# Altium schematic sheet BMD_RevB_B2_TX.SchDoc: TargetX
size 401 x 291 mm; DocumentNumber: 2; SheetNumber: 2; SheetTotal: 6
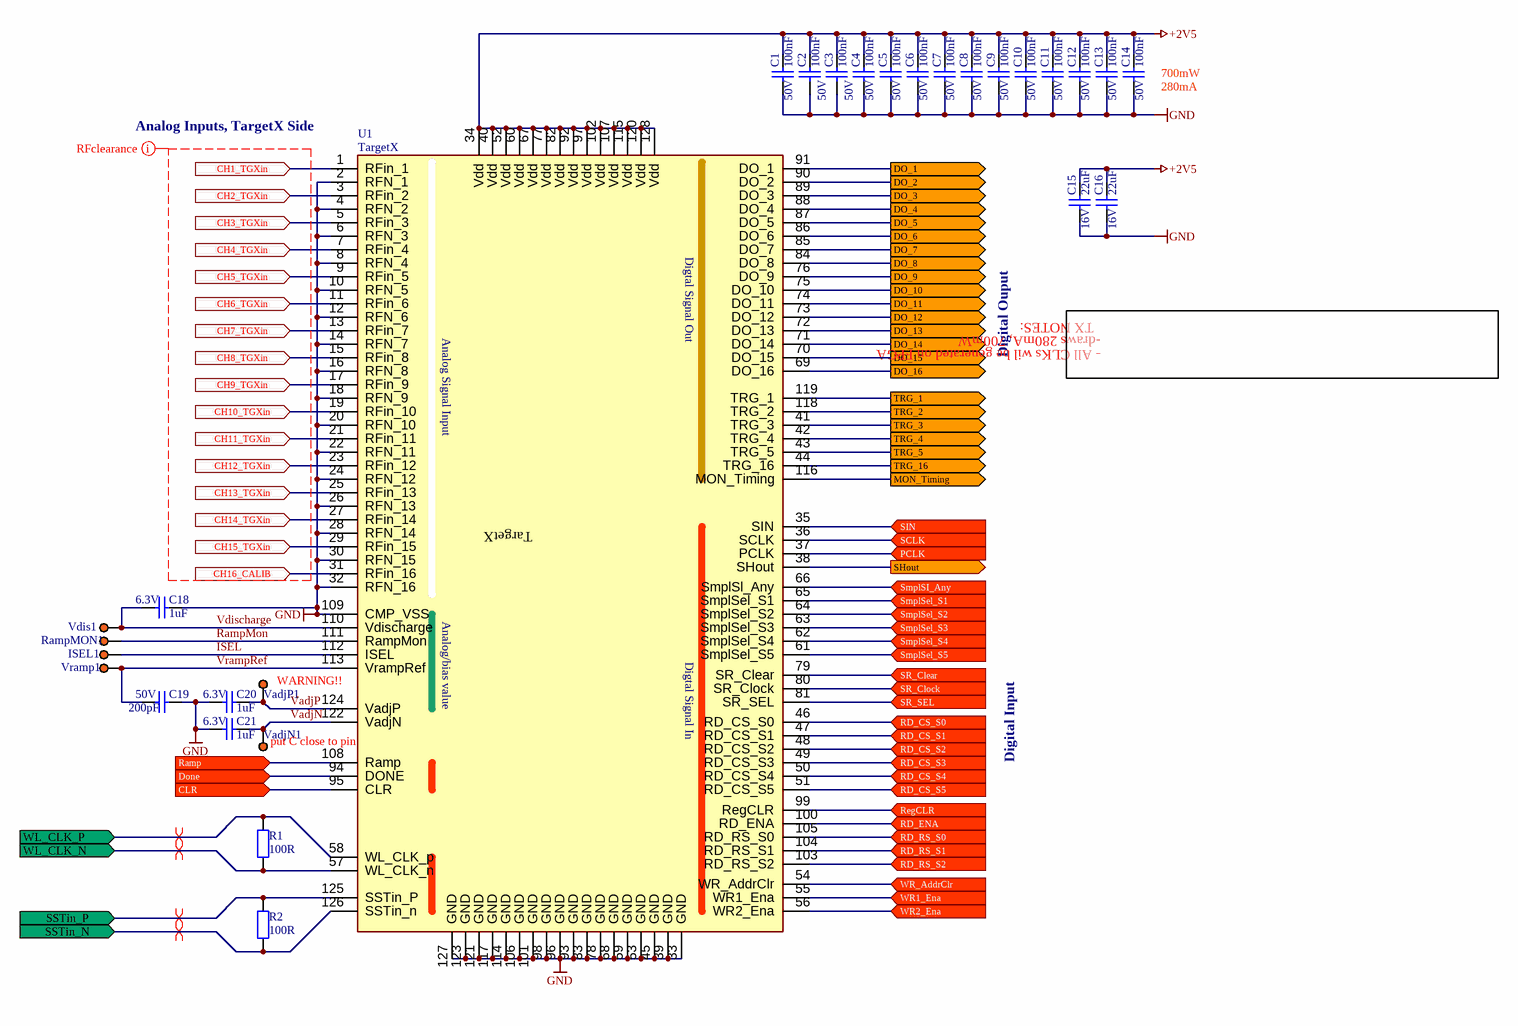
[diagram p0: BMD_RevB_B2_TX.SchDoc]

## Parts
C1  100nF  Voltage rating: 50V  [CC0402N1R]
C2  100nF  Voltage rating: 50V  [CC0402N1R]
C3  100nF  Voltage rating: 50V  [CC0402N1R]
C4  100nF  Voltage rating: 50V  [CC0402N1R]
C5  100nF  Voltage rating: 50V  [CC0402N1R]
C6  100nF  Voltage rating: 50V  [CC0402N1R]
C7  100nF  Voltage rating: 50V  [CC0402N1R]
C8  100nF  Voltage rating: 50V  [CC0402N1R]
C9  100nF  Voltage rating: 50V  [CC0402N1R]
C10  100nF  Voltage rating: 50V  [CC0402N1R]
C11  100nF  Voltage rating: 50V  [CC0402N1R]
C12  100nF  Voltage rating: 50V  [CC0402N1R]
C13  100nF  Voltage rating: 50V  [CC0402N1R]
C14  100nF  Voltage rating: 50V  [CC0402N1R]
C15  22uF  Voltage rating: 16V  [CC0805N1R]
C16  22uF  Voltage rating: 16V  [CC0805N1R]
C18  1uF  Voltage rating: 6.3V  [CC0402N1R]
C19  200pF  Voltage rating: 50V  [CC0402N1R]
C20  1uF  Voltage rating: 6.3V  [CC0402N1R]
C21  1uF  Voltage rating: 6.3V  [CC0402N1R]
ISEL1  SP1.5S  [SP1.5SQ]  (value not drawn)  (no BOM)
R1  100R  [RC0402N1R]
R2  100R  [RC0402N1R]
RampMON1  SP1.5S  [SP1.5SQ]  (value not drawn)  (no BOM)
U1  TargetX  [TQFP128_MZA]
VadjN1  SP1.5S  [SP1.5SQ]  (value not drawn)  (no BOM)
VadjP1  SP1.5S  [SP1.5SQ]  (value not drawn)  (no BOM)
Vdis1  SP1.5S  [SP1.5SQ]  (value not drawn)  (no BOM)
Vramp1  SP1.5S  [SP1.5SQ]  (value not drawn)  (no BOM)

## Ports
CH1_TGXin (in), CH2_TGXin (in), CH3_TGXin (in), CH4_TGXin (in), CH5_TGXin (in), CH6_TGXin (in), CH7_TGXin (in), CH8_TGXin (in), CH9_TGXin (in), CH10_TGXin (in), CH11_TGXin (in), CH12_TGXin (in), CH13_TGXin (in), CH14_TGXin (in), CH15_TGXin (in), CH16_CALIB (in), CLR (in), DO_1 (out), DO_2 (out), DO_3 (out), DO_4 (out), DO_5 (out), DO_6 (out), DO_7 (out), DO_8 (out), DO_9 (out), DO_10 (out), DO_11 (out), DO_12 (out), DO_13 (out), DO_14 (out), DO_15 (out), DO_16 (out), Done (in), MON_Timing (out), PCLK (in), Ramp (in), RD_CS_S0 (in), RD_CS_S1 (in), RD_CS_S2 (in), RD_CS_S3 (in), RD_CS_S4 (in), RD_CS_S5 (in), RD_ENA (in), RD_RS_S0 (in), RD_RS_S1 (in), RD_RS_S2 (in), RegCLR (in), SCLK (in), SHout (out), SIN (in), SmplSel_S1 (in), SmplSel_S2 (in), SmplSel_S3 (in), SmplSel_S4 (in), SmplSel_S5 (in), SmplSI_Any (in), SR_Clear (in), SR_Clock (in), SR_SEL (in), SSTin_N (in), SSTin_P (in), TRG_1 (out), TRG_2 (out), TRG_3 (out), TRG_4 (out), TRG_5 (out), TRG_16 (out), WL_CLK_N (in), WL_CLK_P (in), WR1_Ena (in), WR2_Ena (in), WR_AddrClr (in)

## Nets
+2V5: C1.2 C2.2 C3.2 C4.2 C5.2 C6.2 C7.2 C8.2 C9.2 C10.2 C11.2 C12.2 C13.2 C14.2 C15.2 C16.2 U1.34(Vdd) U1.40(Vdd) U1.52(Vdd) U1.60(Vdd) U1.67(Vdd) U1.77(Vdd) U1.82(Vdd) U1.92(Vdd) U1.97(Vdd) U1.102(Vdd) U1.107(Vdd) U1.115(Vdd) U1.120(Vdd) U1.128(Vdd)
GND: C1.1 C2.1 C3.1 C4.1 C5.1 C6.1 C7.1 C8.1 C9.1 C10.1 C11.1 C12.1 C13.1 C14.1 C15.1 C16.1 C18.2 C19.1 C20.1 C21.1 U1.2(RFN_1) U1.4(RFN_2) U1.6(RFN_3) U1.8(RFN_4) U1.10(RFN_5) U1.12(RFN_6) U1.14(RFN_7) U1.16(RFN_8) U1.18(RFN_9) U1.20(RFN_10) U1.22(RFN_11) U1.24(RFN_12) U1.26(RFN_13) U1.28(RFN_14) U1.30(RFN_15) U1.32(RFN_16) U1.33(GND) U1.39(GND) U1.45(GND) U1.53(GND) U1.59(GND) U1.68(GND) U1.78(GND) U1.83(GND) U1.93(GND) U1.96(GND) U1.98(GND) U1.101(GND) U1.106(GND) U1.109(CMP_VSS) U1.114(GND) U1.117(GND) U1.121(GND) U1.123(GND) U1.127(GND)
CH1_TGXin: U1.1(RFin_1) ; port CH1_TGXin
CH2_TGXin: U1.3(RFin_2) ; port CH2_TGXin
CH3_TGXin: U1.5(RFin_3) ; port CH3_TGXin
CH4_TGXin: U1.7(RFin_4) ; port CH4_TGXin
CH5_TGXin: U1.9(RFin_5) ; port CH5_TGXin
CH6_TGXin: U1.11(RFin_6) ; port CH6_TGXin
CH7_TGXin: U1.13(RFin_7) ; port CH7_TGXin
CH8_TGXin: U1.15(RFin_8) ; port CH8_TGXin
CH9_TGXin: U1.17(RFin_9) ; port CH9_TGXin
CH10_TGXin: U1.19(RFin_10) ; port CH10_TGXin
CH11_TGXin: U1.21(RFin_11) ; port CH11_TGXin
CH12_TGXin: U1.23(RFin_12) ; port CH12_TGXin
CH13_TGXin: U1.25(RFin_13) ; port CH13_TGXin
CH14_TGXin: U1.27(RFin_14) ; port CH14_TGXin
CH15_TGXin: U1.29(RFin_15) ; port CH15_TGXin
CH16_CALIB: U1.31(RFin_16) ; port CH16_CALIB
CLR: U1.95(CLR) ; port CLR
DO_1: U1.91(DO_1) ; port DO_1
DO_2: U1.90(DO_2) ; port DO_2
DO_3: U1.89(DO_3) ; port DO_3
DO_4: U1.88(DO_4) ; port DO_4
DO_5: U1.87(DO_5) ; port DO_5
DO_6: U1.86(DO_6) ; port DO_6
DO_7: U1.85(DO_7) ; port DO_7
DO_8: U1.84(DO_8) ; port DO_8
DO_9: U1.76(DO_9) ; port DO_9
DO_10: U1.75(DO_10) ; port DO_10
DO_11: U1.74(DO_11) ; port DO_11
DO_12: U1.73(DO_12) ; port DO_12
DO_13: U1.72(DO_13) ; port DO_13
DO_14: U1.71(DO_14) ; port DO_14
DO_15: U1.70(DO_15) ; port DO_15
DO_16: U1.69(DO_16) ; port DO_16
Done: U1.94(DONE) ; port Done
ISEL: ISEL1.1 U1.112(ISEL)
MON_Timing: U1.116(MON_Timing) ; port MON_Timing
PCLK: U1.37(PCLK) ; port PCLK
Ramp: U1.108(Ramp) ; port Ramp
RampMon: RampMON1.1 U1.111(RampMon)
RD_CS_S0: U1.46(RD_CS_S0) ; port RD_CS_S0
RD_CS_S1: U1.47(RD_CS_S1) ; port RD_CS_S1
RD_CS_S2: U1.48(RD_CS_S2) ; port RD_CS_S2
RD_CS_S3: U1.49(RD_CS_S3) ; port RD_CS_S3
RD_CS_S4: U1.50(RD_CS_S4) ; port RD_CS_S4
RD_CS_S5: U1.51(RD_CS_S5) ; port RD_CS_S5
RD_ENA: U1.100(RD_ENA) ; port RD_ENA
RD_RS_S0: U1.105(RD_RS_S0) ; port RD_RS_S0
RD_RS_S1: U1.104(RD_RS_S1) ; port RD_RS_S1
RD_RS_S2: U1.103(RD_RS_S2) ; port RD_RS_S2
RegCLR: U1.99(RegCLR) ; port RegCLR
SCLK: U1.36(SCLK) ; port SCLK
SHout: U1.38(SHout) ; port SHout
SIN: U1.35(SIN) ; port SIN
SmplSel_S1: U1.65(SmplSel_S1) ; port SmplSel_S1
SmplSel_S2: U1.64(SmplSel_S2) ; port SmplSel_S2
SmplSel_S3: U1.63(SmplSel_S3) ; port SmplSel_S3
SmplSel_S4: U1.62(SmplSel_S4) ; port SmplSel_S4
SmplSel_S5: U1.61(SmplSel_S5) ; port SmplSel_S5
SmplSI_Any: U1.66(SmplSl_Any) ; port SmplSI_Any
SR_Clear: U1.79(SR_Clear) ; port SR_Clear
SR_Clock: U1.80(SR_Clock) ; port SR_Clock
SR_SEL: U1.81(SR_SEL) ; port SR_SEL
SSTin_N: R2.1 U1.126(SSTin_n) ; port SSTin_N
SSTin_P: R2.2 U1.125(SSTin_P) ; port SSTin_P
TRG_1: U1.119(TRG_1) ; port TRG_1
TRG_2: U1.118(TRG_2) ; port TRG_2
TRG_3: U1.41(TRG_3) ; port TRG_3
TRG_4: U1.42(TRG_4) ; port TRG_4
TRG_5: U1.43(TRG_5) ; port TRG_5
TRG_16: U1.44(TRG_16) ; port TRG_16
VadjN: C21.2 U1.122(VadjN) VadjN1.1
VadjP: C20.2 U1.124(VadjP) VadjP1.1
Vdischarge: C18.1 U1.110(Vdischarge) Vdis1.1
VrampRef: C19.2 U1.113(VrampRef) Vramp1.1
WL_CLK_N: R1.1 U1.57(WL_CLK_n) ; port WL_CLK_N
WL_CLK_P: R1.2 U1.58(WL_CLK_p) ; port WL_CLK_P
WR1_Ena: U1.55(WR1_Ena) ; port WR1_Ena
WR2_Ena: U1.56(WR2_Ena) ; port WR2_Ena
WR_AddrClr: U1.54(WR_AddrClr) ; port WR_AddrClr

## Layout directives
net class RF: (no net found under the mark)
differential pair: SSTin_N, SSTin_P, WL_CLK_N, WL_CLK_P

## Notes on the sheet
- (near C14) 700mW
- (near C14) 280mA
- (near U1) Analog Inputs, TargetX Side
- Digital Ouput
- TX NOTES:
- -draws 280mA, 700mW
- - All CLKs wil be generated on FPGA
- (near U1) TargetX
- (near VadjP1) WARNING!!
- (near U1) put C close to pin
- Digital Input
- Board:
- High Energy Physics Group, Instrumentation Development Lab
- Drawn By:
- Designer:
- Approved By:
- Revision:
- IDLAB design #:
- Variant:
- Sheet Title:
- Modif. Date:
- Sheet       of
- (in symbol DIGITZ_TargetX) Digtal Signal Out; Analog Signal Input; Analog/bias value; Digtal Signal In

## Library data of the parts
C1-C14 = CAPCC0402_100N_50VX7R: 0.10µF 50V Ceramic Capacitor X7R 0402; Manufacturer: TDK; Manufacturer No: C1005X7R1H104K050BB; Tech: SMDR; Package: Cap Chip 0402; Supplier 1: Digi-Key; Supplier Part Number 1: 445-5932-1-ND
C15 C16 = CAPCC0805_22U_16VX7R: 22µF 16V Ceramic Capacitor X5R 0805; Manufacturer: Murata; Manufacturer No: GRM219R61C226ME15L; Tech: SMDR; Package: Cap Chip 0805; Supplier 1: Digi-Key; Supplier Part Number 1: 490-9952-1-ND
C18 C20 C21 = CAPCC0402_1.0U_50VX7R: 1µF 6.3V Ceramic Capacitor X7R 0402; Manufacturer: TDK; Manufacturer No: GRM155R70J105KA12D; Tech: SMDR; Package: Cap Chip 0402; Supplier 1: Digi-Key; Supplier Part Number 1: 490-10024-1-ND
C19 = CAPCC0402_200P_50VNP0: Capacitor chip ceramic 0402 50V NPO; Manufacturer: Murata; Manufacturer No: GRM1555C1H201JA01D; Tech: SMDR; Package: Cap Chip 0402; Supplier 1: Digi-Key; Supplier Part Number 1: 490-3232-1-ND
ISEL1 RampMON1 VadjN1 VadjP1 Vdis1 Vramp1 = SP1.5S: Wire solder pin 1.5mm; Sort: 610; Tech: THDW; Price: 0
R1 R2 = RES0402-100R-1%100PPM: RES SMD 100 OHM 1% 1/10W 0402; Manufacturer: Panasonic; Manufacturer No: ERJ-2RKF1000X; Tech: SMDR; Package: Res Chip 0402; Supplier 1: Digi-Key; Supplier Part Number 1: P100LCT-ND
U1 = DIGITZ_TargetX: 16-channel, 1GSPS Transient Waveform Recorder; Manufacturer: UHM_IDL; Tech: SMDR; Manufacturer No: TargetX; Package: TQFP128; Supplier 1: UHM_IDL; Supplier Part Number 1: TargetX; Supplier Order Qty 1: 1; Supplier Unit Price 1: 0